# EAGLE schematic Motormnt (EAGLE 8.4.0)
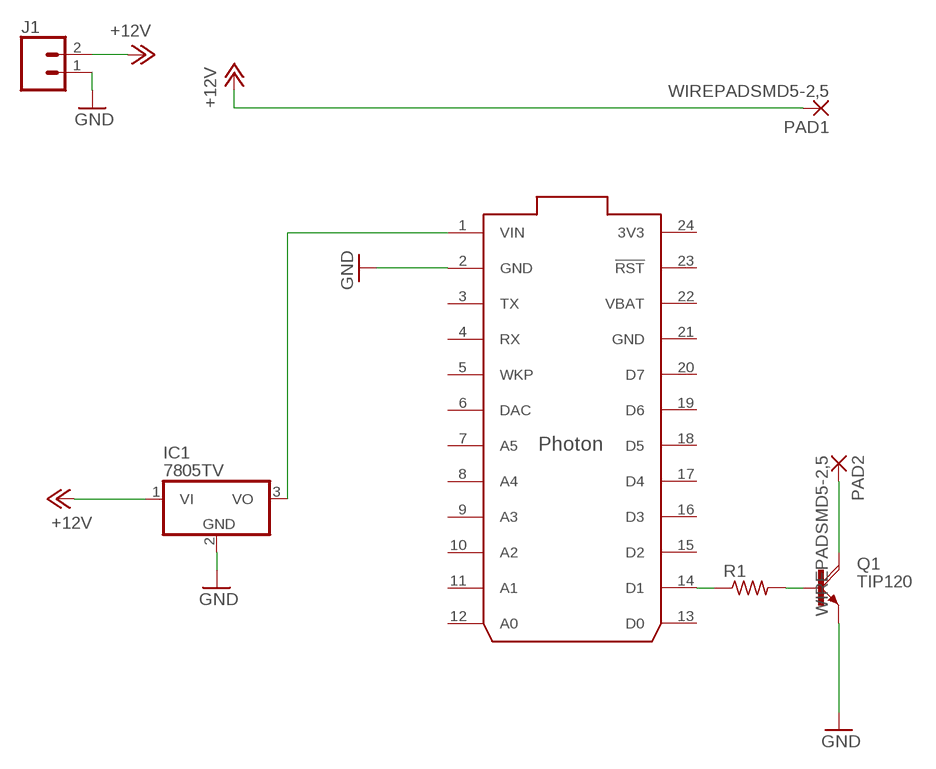
[diagram p0: schematic, sheet 1]

## Parts
IC1  7805TV  [TO220V]
J1  CONN_02PTH3  [1X02_LONGPADS]
PAD1  WIREPADSMD5-2,5  [5-2,5]
PAD2  WIREPADSMD5-2,5  [5-2,5]
Q1  TIP120  [TO220AH]
R1  R-US_0207/7  [0207/7]
U$1  PHOTON_WITH_HEADERS  [PHOTON]

## Nets
+12V: IC1.1(VI) J1.2 PAD1.1(P)
GND: IC1.2(GND) J1.1 Q1.E U$1.2(GND)
N$1: R1.1 U$1.14(D1)
N$2: PAD2.1(P) Q1.C
N$3: IC1.3(VO) U$1.1(VIN)
N$4: Q1.B R1.2
Unconnected: U$1.3(TX) U$1.4(RX) U$1.5(WKP) U$1.6(DAC) U$1.7(A5) U$1.8(A4) U$1.9(A3) U$1.10(A2) U$1.11(A1) U$1.12(A0) U$1.13(D0) U$1.15(D2) U$1.16(D3) U$1.17(D4) U$1.18(D5) U$1.19(D6) U$1.20(D7) U$1.23(!RST)

## Power pins joined to a net without a drawn wire
3V3: U$1.24(3V3)
GND: U$1.21(GND)
VBAT: U$1.22(VBAT)

## Library data of the parts
IC1 = linear:78*: Positive VOLTAGE REGULATOR Source: http://cache.national.com/ds/LM/LM78L05.pdf http://www.fairchildsemi.com/ds/LM/LM7805.pdf
J1 = SparkFun-Connectors:CONN_02: Multi connection point. Often used as Generic Header-pin footprint for 0.1 inch spaced/style header connections On any of the 0.1 inch spaced packages, you can populate with these: Break Away Headers - Straight <https://www.sparkfun.com/products/116> (PRT-00116) Break Away Male Headers - Right Angle <https://www.sparkfun.com/products/553> (PRT-00553) Female Headers <https://www.sparkfun.com/products/115> (PRT-00115) Break Away Headers - Machine Pin <https://www.sparkfun.com/products/117> (PRT-00117) Break Away Female Headers - Swiss Machine Pin <https://www.sparkfun.com/products/743> (PRT-00743) For SCREWTERMINALS and SPRING TERMINALS visit here: Screw Terimnals on SparkFun.com <https://www.sparkfun.com/search/results?term=Screw+Terminals> (5mm/3.5mm/2.54mm spacing) This device is also useful as a general connection point to wire up your design to another part of your project. Our various solder wires solder well into these plated through hole pads. Hook-Up Wire - Assortment (Stranded, 22 AWG) <https://www.sparkfun.com/products/11375> (PRT-11375) Hook-Up Wire - Assortment (Solid Core, 22 AWG) <https://www.sparkfun.com/products/11367> (PRT-11367) View the entire wire category on our website here <https://www.sparkfun.com/categories/141> Special notes: Molex polarized connector foot print use with: PRT-08233 with associated crimp pins and housings. 2.54_SCREWTERM for use with PRT-10571. 3.5mm Screw Terminal footprints for PRT-08084 5mm Screw Terminal footprints for use with PRT-08432
PAD1 PAD2 = wirepad:WIREPAD: Wire PAD connect wire on PCB
Q1 = transistor-power:TIP120: NPN DARLINGTON TRANSISTOR
R1 = resistor:R-US_: RESISTOR, American symbol
U$1 = Spark:PHOTON